# EAGLE design Mbus_1.2 (EAGLE 9.6.2)
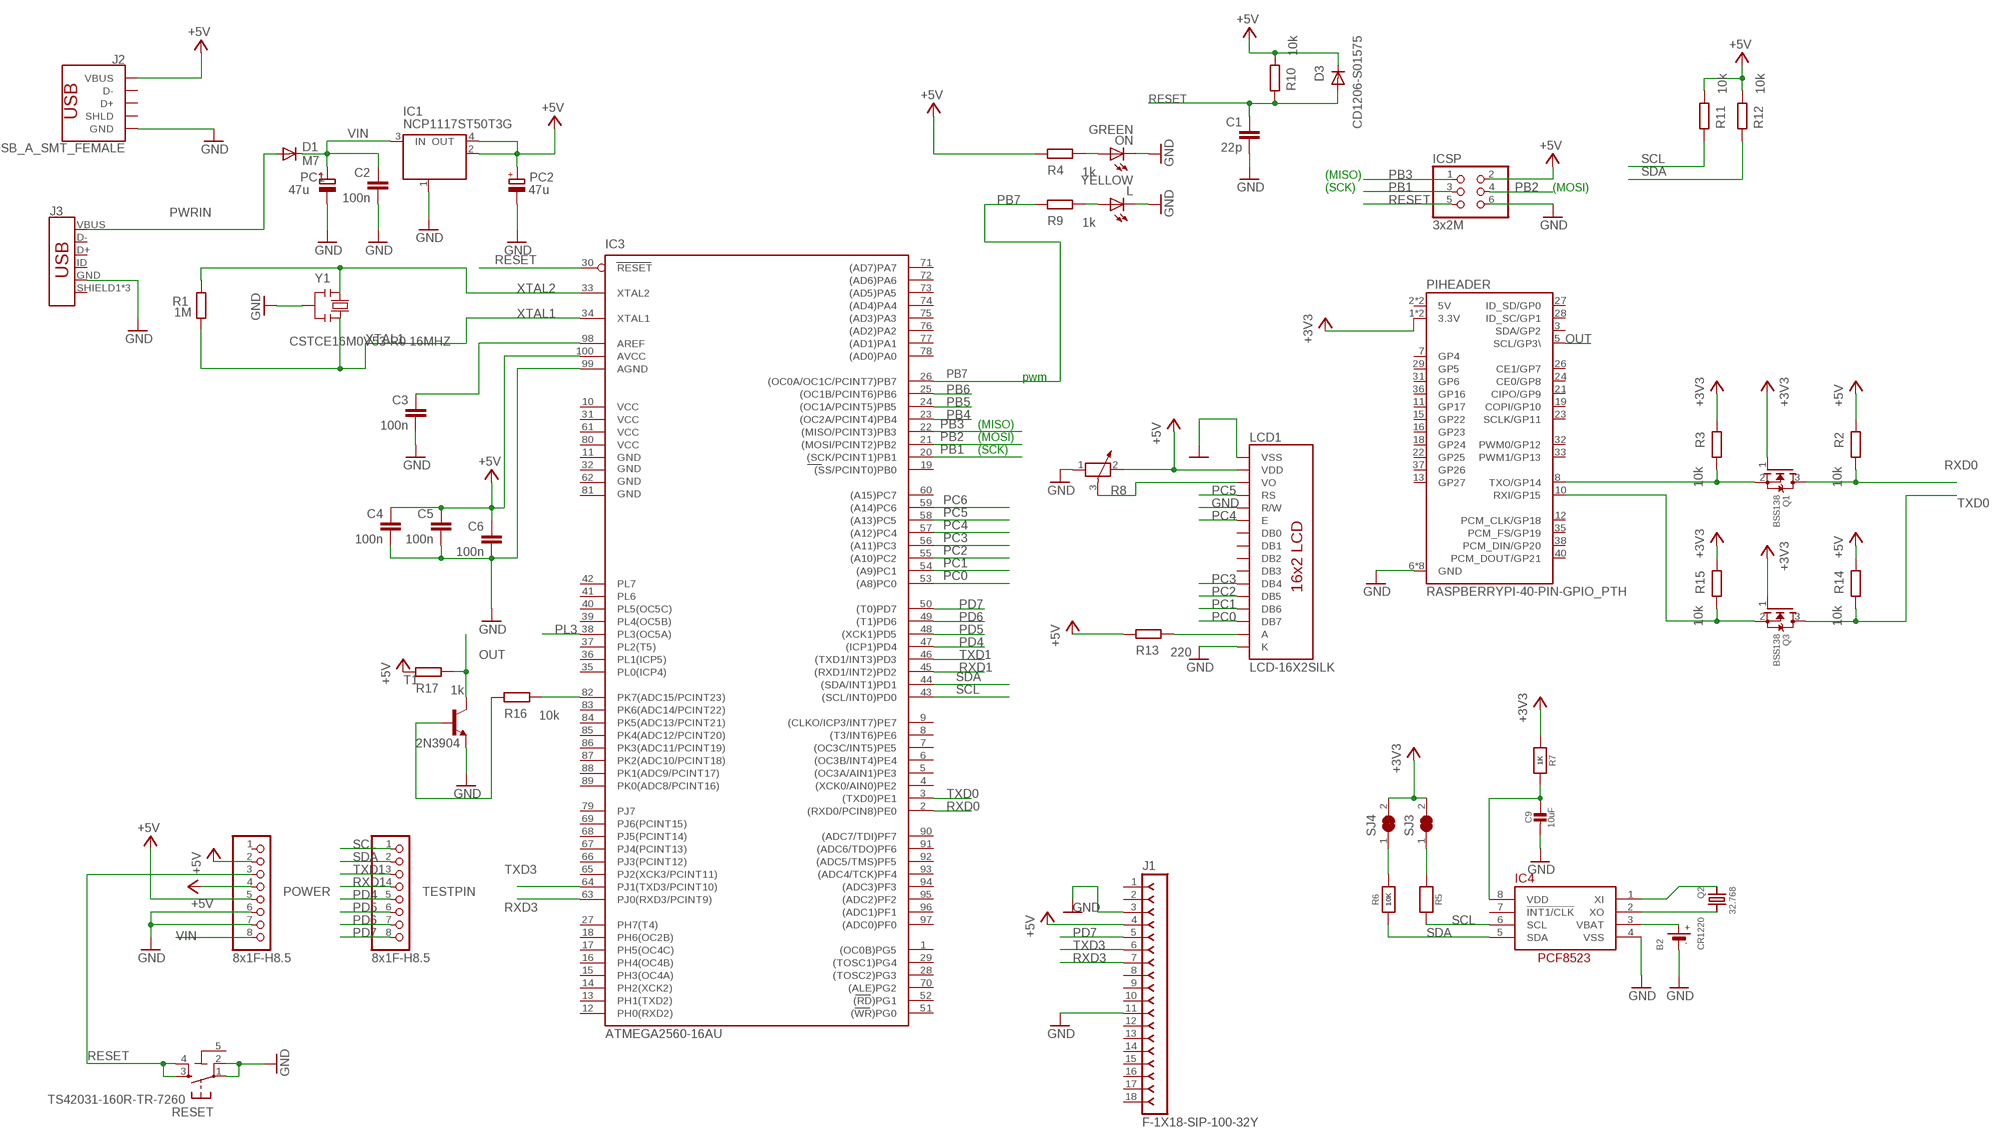
[diagram p0: schematic, sheet 1]

## Parts
B2  CR1220  BATTERYCR1220_SMT  [CR1220]
C1  22p  C-EU0603-RND  [C0603-ROUND]
C2  100n  C-EU0603-RND  [C0603-ROUND]
C3  100n  C-EU0603-RND  [C0603-ROUND]
C4  100n  C-EU0603-RND  [C0603-ROUND]
C5  100n  C-EU0603-RND  [C0603-ROUND]
C6  100n  C-EU0603-RND  [C0603-ROUND]
C9  10uF  CAP_CERAMIC0805-NOOUTLINE  [0805-NO]
D1  M7  DIODE-SMB  [SMB]
D3  CD1206-S01575  DIODE-MINIMELF  [MINIMELF]
IC1  NCP1117ST50T3G  MC33269ST-3.3T3  [SOT223]
IC3  ATMEGA2560-16AU  ATMEGA25602560-16AU  [TQFP100]
IC4  RTC_PCF8523T  [SOIC8_150MIL]
ICSP  3x2M  PINHD-2X3  [2X03]
J1  F-1X18-SIP-100-32Y  [SIP-100-18-32Y]
J2  USB_A_SMT_FEMALE  [USB-A-S-SILK-FEMALE]
J3  USB_MICRO-B_FEMALE-SMT  [USB-B-MICRO-SMD]
L  YELLOW  LEDCHIP-LED0805  [CHIP-LED0805]
LCD1  LCD-16X2SILK  [LCD-16X2]
ON  GREEN  LEDCHIP-LED0805  [CHIP-LED0805]
PC1  47u  CPOL-EUD  [PANASONIC_D]
PC2  47u  CPOL-EUD  [PANASONIC_D]
PIHEADER  RASPBERRYPI-40-PIN-GPIO_PTH  [2X20_SHROUDED]
POWER  8x1F-H8.5  PINHD-1X8  [1X08]
Q1  BSS138  MOSFET-NREFLOW  [SOT23]
Q2  32.768  CRYSTAL8.0X3.8  [CRYSTAL_8X3.8]
Q3  BSS138  MOSFET-NREFLOW  [SOT23]
R1  1M  R-EU_R0603  [R0603-ROUND]
R2  10k  R-EU_R0603  [R0603-ROUND]
R3  10k  R-EU_R0603  [R0603-ROUND]
R4  1k  R-EU_R0603  [R0603-ROUND]
R5  10K  RESISTOR0805_NOOUTLINE  [0805-NO]
R6  10K  RESISTOR0805_NOOUTLINE  [0805-NO]
R7  1K  RESISTOR0805_NOOUTLINE  [0805-NO]
R8  POTENTIOMETER_PT-10  [PT-10]
R9  1k  R-EU_R0603  [R0603-ROUND]
R10  10k  R-EU_R0603  [R0603-ROUND]
R11  10k  R-EU_R0603  [R0603-ROUND]
R12  10k  R-EU_R0603  [R0603-ROUND]
R13  220  R-EU_R0603  [R0603-ROUND]
R14  10k  R-EU_R0603  [R0603-ROUND]
R15  10k  R-EU_R0603  [R0603-ROUND]
R16  10k  R-EU_R0603  [R0603-ROUND]
R17  1k  R-EU_R0603  [R0603-ROUND]
RESET  TS42031-160R-TR-7260  TS42  [TS42]
SJ3  SOLDERJUMPER_CLOSED  [SOLDERJUMPER_CLOSEDWIRE]
SJ4  SOLDERJUMPER_CLOSED  [SOLDERJUMPER_CLOSEDWIRE]
T1  2N3904  [TO92]
TESTPIN  8x1F-H8.5  PINHD-1X8  [1X08]
Y1  CSTCE16M0V53-R0 16MHZ  RESONATORMU  [RESONATOR]

## Nets
+3V3 [power]: PIHEADER.1(3.3V) PIHEADER.17(3.3V) Q1.1(G) Q3.1(G) R3.2 R7.1 R15.2 SJ3.2 SJ4.2
+5V [power]: C4.1 C5.1 C6.1 D3.C IC1.2(OUT) IC1.4(OUT) IC3.100(AVCC) ICSP.2 J1.4 J2.VBUS LCD1.2(VDD) PC2.+ POWER.2 POWER.4 POWER.5 R2.2 R4.2 R8.2 R10.1 R11.1 R12.1 R13.2 R14.2 R17.2
AREF: C3.1 IC3.98(AREF)
GND [gnd]: B2.- C1.2 C2.2 C3.2 C4.2 C5.2 C6.2 C9.2 IC1.1(GND/ADJ) IC3.99(AGND) IC4.4(VSS) ICSP.6 J1.3 J1.11 J2.GND J3.GND L.C LCD1.1(VSS) LCD1.5(R/W) LCD1.16(K) ON.C PC1.- PC2.- PIHEADER.6(GND) PIHEADER.9(GND) PIHEADER.14(GND) PIHEADER.20(GND) PIHEADER.25(GND) PIHEADER.30(GND) PIHEADER.34(GND) PIHEADER.39(GND) POWER.6 POWER.7 R8.1 RESET.1 RESET.2 T1.3(E) Y1.2
N$1: IC3.82(PK7(ADC15/PCINT23)) R16.1
N$2: L.A R9.1
N$3: ON.A R4.1
N$4: R16.2 T1.2(B)
N$5: PIHEADER.8(TXO/GP14) Q1.2(S) R3.1
N$6: IC4.1(XI) Q2.P$1
N$7: IC4.2(XO) Q2.P$4
N$8: R5.1 SJ3.1
N$9: R6.2 SJ4.1
N$10: C9.1 IC4.8(VDD) R7.2
N$11: LCD1.15(A) R13.1
N$12: PIHEADER.10(RXI/GP15) Q3.2(S) R15.1
N$22: LCD1.3(VO) R8.3
OUT: PIHEADER.5(SCL/GP3\) R17.1 T1.1(C)
PB1: IC3.20((SCK/PCINT1)PB1) ICSP.3
PB2: IC3.21((MOSI/PCINT2)PB2) ICSP.4
PB3: IC3.22((MISO/PCINT3)PB3) ICSP.1
PB4: IC3.23((OC2A/PCINT4)PB4)
PB5: IC3.24((OC1A/PCINT5)PB5)
PB6: IC3.25((OC1B/PCINT6)PB6)
PB7: IC3.26((OC0A/OC1C/PCINT7)PB7) R9.2
PC0: IC3.53((A8)PC0) LCD1.14(DB7)
PC1: IC3.54((A9)PC1) LCD1.13(DB6)
PC2: IC3.55((A10)PC2) LCD1.12(DB5)
PC3: IC3.56((A11)PC3) LCD1.11(DB4)
PC4: IC3.57((A12)PC4) LCD1.6(E)
PC5: IC3.58((A13)PC5) LCD1.4(RS)
PC6: IC3.59((A14)PC6)
PD4: IC3.47((ICP1)PD4) TESTPIN.5
PD5: IC3.48((XCK1)PD5) TESTPIN.6
PD6: IC3.49((T1)PD6) TESTPIN.7
PD7: IC3.50((T0)PD7) J1.5 TESTPIN.8
PL3: IC3.38(PL3(OC5A))
PWRIN [power]: D1.A J3.VBUS
RESET: C1.1 D3.A IC3.30(RESET) ICSP.5 POWER.3 R10.2 RESET.3 RESET.4
RXD0: IC3.2((RXD0/PCIN8)PE0) Q1.3(D) R2.1
RXD1: IC3.45((RXD1/INT2)PD2) TESTPIN.4
RXD3: IC3.63(PJ0(RXD3/PCINT9)) J1.7
SCL: IC3.43((SCL/INT0)PD0) IC4.6(SCL) R5.2 R11.2 TESTPIN.1
SDA: IC3.44((SDA/INT1)PD1) IC4.5(SDA) R6.1 R12.2 TESTPIN.2
TXD0: IC3.3((TXD0)PE1) Q3.3(D) R14.1
TXD1: IC3.46((TXD1/INT3)PD3) TESTPIN.3
TXD3: IC3.64(PJ1(TXD3/PCINT10)) J1.6
VBAT1: B2.+$1(+) IC4.3(VBAT)
VIN [power]: C2.1 D1.C IC1.3(IN) PC1.+ POWER.8
XTAL1: IC3.34(XTAL1) R1.1 Y1.3
XTAL2: IC3.33(XTAL2) R1.2 Y1.1
Unconnected: IC3.1((OC0B)PG5) IC3.4((XCK0/AIN0)PE2) IC3.5((OC3A/AIN1)PE3) IC3.6((OC3B/INT4)PE4) IC3.7((OC3C/INT5)PE5) IC3.8((T3/INT6)PE6) IC3.9((CLKO/ICP3/INT7)PE7) IC3.12(PH0(RXD2)) IC3.13(PH1(TXD2)) IC3.14(PH2(XCK2)) IC3.15(PH3(OC4A)) IC3.16(PH4(OC4B)) IC3.17(PH5(OC4C)) IC3.18(PH6(OC2B)) IC3.19((SS/PCINT0)PB0) IC3.27(PH7(T4)) IC3.28((TOSC2)PG3) IC3.29((TOSC1)PG4) IC3.35(PL0(ICP4)) IC3.36(PL1(ICP5)) IC3.37(PL2(T5)) IC3.39(PL4(OC5B)) IC3.40(PL5(OC5C)) IC3.41(PL6) IC3.42(PL7) IC3.51((WR)PG0) IC3.52((RD)PG1) IC3.60((A15)PC7) IC3.65(PJ2(XCK3/PCINT11)) IC3.66(PJ3(PCINT12)) IC3.67(PJ4(PCINT13)) IC3.68(PJ5(PCINT14)) IC3.69(PJ6(PCINT15)) IC3.70((ALE)PG2) IC3.71((AD7)PA7) IC3.72((AD6)PA6) IC3.73((AD5)PA5) IC3.74((AD4)PA4) IC3.75((AD3)PA3) IC3.76((AD2)PA2) IC3.77((AD1)PA1) IC3.78((AD0)PA0) IC3.79(PJ7) IC3.83(PK6(ADC14/PCINT22)) IC3.84(PK5(ADC13/PCINT21)) IC3.85(PK4(ADC12/PCINT20)) IC3.86(PK3(ADC11/PCINT19)) IC3.87(PK2(ADC10/PCINT18)) IC3.88(PK1(ADC9/PCINT17)) IC3.89(PK0(ADC8/PCINT16)) IC3.90((ADC7/TDI)PF7) IC3.91((ADC6/TDO)PF6) IC3.92((ADC5/TMS)PF5) IC3.93((ADC4/TCK)PF4) IC3.94((ADC3)PF3) IC3.95((ADC2)PF2) IC3.96((ADC1)PF1) IC3.97((ADC0)PF0) IC4.7(!INT1/CLK) J1.1 J1.2 J1.8 J1.9 J1.10 J1.12 J1.13 J1.14 J1.15 J1.16 J1.17 J1.18 J2.D+ J2.D- J2.SHLD1(SHLD) J2.SHLD2(SHLD) J3.D+ J3.D- J3.ID J3.SHIELD1(SHIELD) J3.SHIELD2(SHIELD) J3.SHIELD3(SHIELD) LCD1.7(DB0) LCD1.8(DB1) LCD1.9(DB2) LCD1.10(DB3) PIHEADER.3(SDA/GP2) PIHEADER.7(GP4) PIHEADER.11(GP17) PIHEADER.12(PCM_CLK/GP18) PIHEADER.13(GP27) PIHEADER.15(GP22) PIHEADER.16(GP23) PIHEADER.18(GP24) PIHEADER.19(COPI/GP10) PIHEADER.21(CIPO/GP9) PIHEADER.22(GP25) PIHEADER.23(SCLK/GP11) PIHEADER.24(CE0/GP8) PIHEADER.26(CE1/GP7) PIHEADER.27(ID_SD/GP0) PIHEADER.28(ID_SC/GP1) PIHEADER.29(GP5) PIHEADER.31(GP6) PIHEADER.32(PWM0/GP12) PIHEADER.33(PWM1/GP13) PIHEADER.35(PCM_FS/GP19) PIHEADER.36(GP16) PIHEADER.37(GP26) PIHEADER.38(PCM_DIN/GP20) PIHEADER.40(PCM_DOUT/GP21) POWER.1

## Notes on the sheet
- (MISO)
- (SCK) | (MOSI)
- pwm
- (MISO)
- (MOSI)
- (SCK)

## Power pins joined to a net without a drawn wire
5-GND: RESET.5(5-GND)
5V: PIHEADER.2(5V) PIHEADER.4(5V)
GND: IC3.11(GND)
GND1: IC3.32(GND1)
GND2: IC3.62(GND2)
GND3: IC3.81(GND3)
VCC: IC3.10(VCC)
VCC1: IC3.31(VCC1)
VCC2: IC3.61(VCC2)
VCC3: IC3.80(VCC3)

## Library data of the parts
B2 = microbuilder:BATTERY: CR1220 SMT - Digikey: 3001K-ND CD2032 BAT-HLD-001 - Digikey: BAT-HLD-001-ND
C1-C6 = SmartPrj:C-EU: CAPACITOR, European symbol
C9 = microbuilder:CAP_CERAMIC: Ceramic Capacitors For new designs, use the packages preceded by an '_' character since they are more reliable: The following footprints should be used on most boards: _0402 - Standard footprint for regular board layouts _0603 - Standard footprint for regular board layouts _0805 - Standard footprint for regular board layouts _1206 - Standard footprint for regular board layouts For extremely tight-pitch boards where space is at a premium, the following 'micro-pitch' footprints can be used (smaller pads, no silkscreen outline, etc.): _0402MP - Micro-pitch footprint for very dense/compact boards _0603MP - Micro-pitch footprint for very dense/compact boards _0805MP - Micro-pitch footprint for very dense/compact boards _1206MP - Micro-pitch footprint for very dense/compact boards
D1 D3 = diode:DIODE-: DIODE
IC1 = linear:MC33269ST*: Adjustable Output Low Dropout Voltage Regulator 800 mA Source: http://www.onsemi.com/pub/Collateral/MC33269-D.PDF
IC3 = SmartPrj:ATMEGA2560: MICROCONTROLLER 64/128/256 Kbytes FLASH 4 Kbytes EEPROM 8 Kbytes SRAM 86 General Purpose I/O pins 12-channels16-bit PWM 4 x Serial USARTs 16-channels 10-bit A/D
IC4 = microbuilder:RTC_PCF8523
ICSP = SmartPrj:PINHD-2X3: PIN HEADER
J1 = con-headers-jp:F-1X18-: FEMALE HEADER
J2 = SparkFun-Connectors:USB_A: USB-A Connector Male and female variants, as well as PTH and SMT variants SparkFun Products: SparkFun XBee Explorer Dongle <https://www.sparkfun.com/products/11697> PTH Male SparkFun MicroView-USB Programmer <https://www.sparkfun.com/products/12924> SMT Male SparkFun USB Type A Female Breakout <https://www.sparkfun.com/products/12700> SMT Female; PROD_ID: CONN-09520; SF_ID: PRT-09011
J3 = SparkFun-Connectors:USB_MICRO-B: USB Type Micro-B Connector Male/female and PTH/SMT variants SparkFun Products: SparkFun microB USB Breakout <https://www.sparkfun.com/products/12035> SparkFun USB microB Plug Breakout <https://www.sparkfun.com/products/10031> SparkFun ESP8266 Thing <https://www.sparkfun.com/products/13231>; PROD_ID: CONN-11752
L ON = led:LED: LED OSRAM: - CHIPLED LG R971, LG N971, LY N971, LG Q971, LY Q971, LO R971, LY R971 LH N974, LH R974 LS Q976, LO Q976, LY Q976 LO Q996 - Hyper CHIPLED LW Q18S LB Q993, LB Q99A, LB R99A - SideLED LS A670, LO A670, LY A670, LG A670, LP A670 LB A673, LV A673, LT A673, LW A673 LH A674 LY A675 LS A676, LA A676, LO A676, LY A676, LW A676 LS A679, LY A679, LG A679 - Hyper Micro SIDELED® LS Y876, LA Y876, LO Y876, LY Y876 LT Y87S - SmartLED LW L88C, LW L88S LB L89C, LB L89S, LG L890 LS L89K, LO L89K, LY L89K LS L896, LA L896, LO L896, LY L896 - TOPLED LS T670, LO T670, LY T670, LG T670, LP T670 LSG T670, LSP T670, LSY T670, LOP T670, LYG T670 LG T671, LOG T671, LSG T671 LB T673, LV T673, LT T673, LW T673 LH T674 LS T676, LA T676, LO T676, LY T676, LB T676, LH T676, LSB T676, LW T676 LB T67C, LV T67C, LT T67C, LS T67K, LO T67K, LY T67K, LW E67C LS E67B, LA E67B, LO E67B, LY E67B, LB E67C, LV E67C, LT E67C LW T67C LS T679, LY T679, LG T679 LS T770, LO T770, LY T770, LG T770, LP T770 LB T773, LV T773, LT T773, LW T773 LH T774 LS E675, LA E675, LY E675, LS T675 LS T776, LA T776, LO T776, LY T776, LB T776 LHGB T686 LT T68C, LB T68C - Hyper Mini TOPLED® LB M676 - Mini TOPLED Santana® LG M470 LS M47K, LO M47K, LY M47K Source: http://www.osram.convergy.de LUXEON: - LUMILED® LXK2-PW12-R00, LXK2-PW12-S00, LXK2-PW14-U00, LXK2-PW14-V00 LXK2-PM12-R00, LXK2-PM12-S00, LXK2-PM14-U00 LXK2-PE12-Q00, LXK2-PE12-R00, LXK2-PE12-S00, LXK2-PE14-T00, LXK2-PE14-U00 LXK2-PB12-K00, LXK2-PB12-L00, LXK2-PB12-M00, LXK2-PB14-N00, LXK2-PB14-P00, LXK2-PB14-Q00 LXK2-PR12-L00, LXK2-PR12-M00, LXK2-PR14-Q00, LXK2-PR14-R00 LXK2-PD12-Q00, LXK2-PD12-R00, LXK2-PD12-S00 LXK2-PH12-R00, LXK2-PH12-S00 LXK2-PL12-P00, LXK2-PL12-Q00, LXK2-PL12-R00 Source: www.luxeon.com KINGBRIGHT: KA-3528ASYC Source: www.kingbright.com
LCD1 = SparkFun-Displays:LCD-16X2: Standard text-only 16x2 parallel input LCD Basic 16 character by 2 line display. Typically utilizes the extremely common HD44780 parallel interface chipset SparkFun Products: Basic 16x2 Green <https://www.sparkfun.com/products/255> Basic 8x2 Green <https://www.sparkfun.com/products/11122>; PROD_ID: LCD-12633; SF_ID: LCD-00255
PC1 PC2 = rcl:CPOL-EU: POLARIZED CAPACITOR, European symbol
PIHEADER = SparkFun-Connectors:RASPBERRYPI-40-PIN-GPIO: Raspberry Pi GPIO Header 2x20 pin connector, as found on B, B+, A+ models. Both shrouded PTH and SMT versions available. SparkFun Products: GPIO Shrouded Header <https://www.sparkfun.com/products/13054>- PTH SparkFun Pi Wedge (Preassembled) <https://www.sparkfun.com/products/13717>; PROD_ID: CONN-12263; SF_ID: PRT-13054
POWER TESTPIN = SmartPrj:PINHD-1X8: PIN HEADER
Q1 Q3 = adafruit:MOSFET-N: N-Channel Mosfet 2N7002E - 60V 260mA SOT23 [Digikey: 2N7002ET1GOSTR-ND] - REEL BSH103 - 30V 850mA SOT23 [Digikey: 568-5013-1-ND]
Q2 = microbuilder:CRYSTAL: Crystals HC49UP - Surface Mount Crystal 4.0MHz 18pF +/-30ppm Surface Mount Crystal [Digikey: 535-9857-1-ND] 12.0 MHz Surface Mount Crystal [Digikey: 535-9869-6-ND] 25.0 MHz Surface Mount Crystal [Digikey: 535-9078-1-ND] 2.5 x 2.0mm - MEMs SMT Crystal 16.0 MHz 10pF 20ppm 2.5 x 2.0mm Crystal [Digikey -40-85°C: 535-10923-1-ND] 3.2 x 2.5mm - MEMs SMT Crystal 12.0 MHz 8pF 15ppm 3.2 x 2.5mm Crystal [Digikey: -10-70°C: 644-1047-1-ND -40-125°C: 644-1128-1-ND] 40~85°C cheaper: 644-1173-6-ND 16.0 MHz 8pF 15ppm 3.2 x 2.5mm Crystal [Digikey: -10-70°C: 644-1049-1-ND -40-125°C: 644-1129-2-ND]-40~85°C cheaper: 644-1175-6-ND 16.0 MHz 10pF 10ppm 3.2 x 2.5mm Crystal [Digikey: 644-1100-1-ND] 27.12 MHz 18pF 30ppm 3.2 x 2.5mm Crystal [Digikey: 887-1424-1-ND] 27.12MHz 10pF 10ppm 3.2 x 2.5mm Crystal [Digikey: 887-1329-1-ND] 4.9 x 1.8mm - MEMs SMT Crystal 32.768 KHz 12.5pF 20ppm 4.9 x 1.8mm Crystal [Digikey: SE2415CT-ND] 8.0 x 3.8mm - Surface Mount Crystal 32.768kHz 12.5pF 20ppm -40°C-85°C [Digikey: 535-9166-2-ND] Cylinder 32.768KHz Cylinder Crystal (2x6mm body) [Ex. Digikey: 300-8341-2-ND]
R1-R4 R9-R17 = SmartPrj:R-EU_: RESISTOR, European symbol
R5-R7 = microbuilder:RESISTOR: Resistors For new designs, use the packages preceded by an '_' character since they are more reliable: The following footprints should be used on most boards: _0402 - Standard footprint for regular board layouts _0603 - Standard footprint for regular board layouts _0805 - Standard footprint for regular board layouts _1206 - Standard footprint for regular board layouts For extremely tight-pitch boards where space is at a premium, the following 'micro-pitch' footprints can be used (smaller pads, no silkscreen outline, etc.): _0402MP - Micro-pitch footprint for very dense/compact boards _0603MP - Micro-pitch footprint for very dense/compact boards _0805MP - Micro-pitch footprint for very dense/compact boards _1206MP - Micro-pitch footprint for very dense/compact boards
R8 = rcl@1:POTENTIOMETER_: Potentiometer; SPICEMODEL: POT; SPICEPREFIX: X
RESET = SmartPrj:TS42: TS42 Dongnan Electronics Tact switch VDC 12V - 50mA
SJ3 SJ4 = microbuilder:SOLDERJUMPER_CLOSED: Solder Jumper - Closed These solder jumpers are closed by default CLOSEDWIRE - 10 mil trace between pads that can be cut and resoldered later CLOSEDPERM - 63 mil trace between pads for a permanent connection (used to 'bridge' two signals, a shameless hack for Eagle). Can double as a test point as well (no cream layer)
T1 = transistor:2N3904: NPN TRANSISTOR
Y1 = SmartPrj:RESONATOR

## Net classes
0 default: width 0.203 mm, drill 0.305 mm, clearance 0.203 mm
1 power: width 0.813 mm, drill 0.864 mm, clearance 0.254 mm
2 gnd: width 0.61 mm, drill 0.66 mm, clearance 0.254 mm
3 power usb: width 0.813 mm, drill 0.864 mm, clearance 0.254 mm

## Board
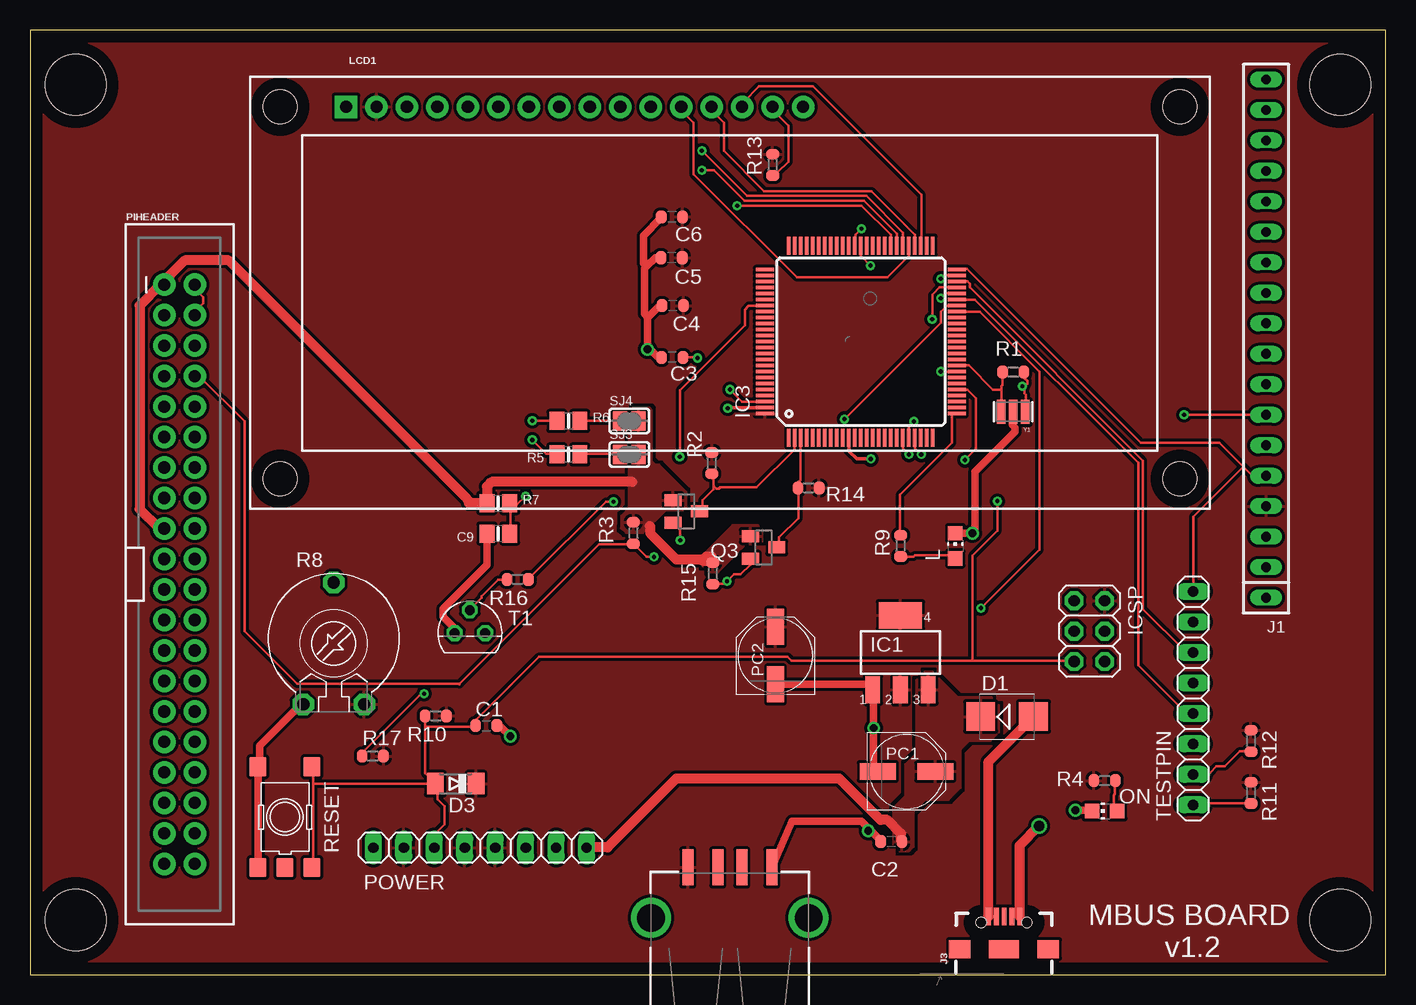
[diagram p1: board, top side]
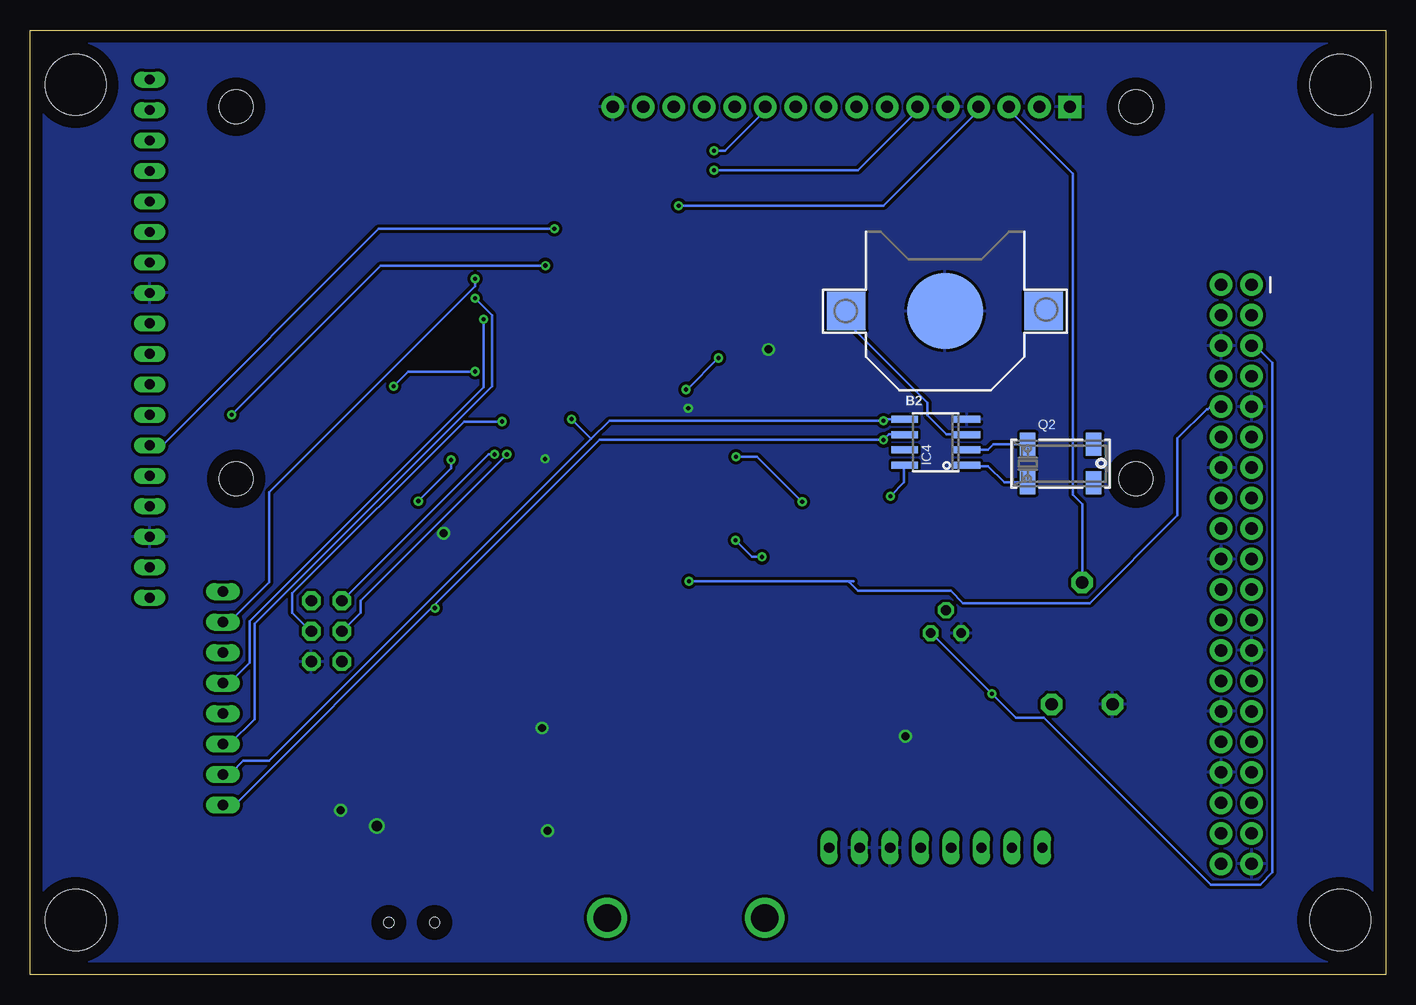
[diagram p2: board, bottom side, seen from below]

Size 113.03 x 78.74 mm. Coordinates in mm from the lower left corner, seen from the top.
Outline: 0,0 113.03,0 113.03,78.74 0,78.74 0,0
Copper layers (1*16): Top 0.035mm / dielectric 1.5mm / Bottom 0.035mm
Design rules "default": minimum track width 6mil, minimum drill 0.35mm, track to track 6mil, track to pad 6mil, pad to pad 6mil, via to via 6mil, smd to smd 6mil, copper to edge 40mil, drill to drill 6mil, minimum pad ring 10mil, minimum via ring 8mil, stop-mask expansion 4mil, vias tented up to drill 0mil, thermal gap 10mil
Holes 5.08 mm at 3.81,74.17 109.22,4.57 109.22,74.17 3.81,4.57

### Footprints (pad centres in the part's own frame; a part is rotated, then mirrored left to right if it is on the bottom)
CR1220 = smd 3.2 x 3.2: +$1 -8.225,0; +$2 8.225,0 | smd 6.35 x 6.35: - 0,0
C0603-ROUND = smd 0.898 x 1.1: 1 -0.889,0; 2 0.889,0
0805-NO = smd 1.24 x 1.5: 1 -0.95,0; 2 0.95,0
SMB = smd 2.4 x 2.4: A 2.2,0; C -2.2,0
MINIMELF = smd 1.4 x 1.8: A 1.7,0; C -1.7,0
SOT223 = smd 1.219 x 2.235: 1 -2.311,-3.099; 2 0,-3.099; 3 2.311,-3.099 | smd 3.6 x 2.2: 4 0,3.099
TQFP100 = smd 1.5 x 0.3: 1 -8,6; 2 -8,5.5; 3 -8,5; 4 -8,4.5; 5 -8,4; 6 -8,3.5; 7 -8,3; 8 -8,2.5; 9 -8,2; 10 -8,1.5; 11 -8,1; 12 -8,0.5; 13 -8,0; 14 -8,-0.5; 15 -8,-1; 16 -8,-1.5; 17 -8,-2; 18 -8,-2.5; 19 -8,-3; 20 -8,-3.5; 21 -8,-4; 22 -8,-4.5; 23 -8,-5; 24 -8,-5.5; 25 -8,-6; 51 8,-6; 52 8,-5.5; 53 8,-5; 54 8,-4.5; 55 8,-4; 56 8,-3.5; 57 8,-3; 58 8,-2.5; 59 8,-2; 60 8,-1.5; 61 8,-1; 62 8,-0.5; 63 8,0; 64 8,0.5; 65 8,1; 66 8,1.5; 67 8,2; 68 8,2.5; 69 8,3; 70 8,3.5; 71 8,4; 72 8,4.5; 73 8,5; 74 8,5.5; 75 8,6 | smd 0.3 x 1.5: 26 -6,-8; 27 -5.5,-8; 28 -5,-8; 29 -4.5,-8; 30 -4,-8; 31 -3.5,-8; 32 -3,-8; 33 -2.5,-8; 34 -2,-8; 35 -1.5,-8; 36 -1,-8; 37 -0.5,-8; 38 0,-8; 39 0.5,-8; 40 1,-8; 41 1.5,-8; 42 2,-8; 43 2.5,-8; 44 3,-8; 45 3.5,-8; 46 4,-8; 47 4.5,-8; 48 5,-8; 49 5.5,-8; 50 6,-8; 76 6,8; 77 5.5,8; 78 5,8; 79 4.5,8; 80 4,8; 81 3.5,8; 82 3,8; 83 2.5,8; 84 2,8; 85 1.5,8; 86 1,8; 87 0.5,8; 88 0,8; 89 -0.5,8; 90 -1,8; 91 -1.5,8; 92 -2,8; 93 -2.5,8; 94 -3,8; 95 -3.5,8; 96 -4,8; 97 -4.5,8; 98 -5,8; 99 -5.5,8; 100 -6,8
SOIC8_150MIL = smd 0.6 x 2.2: 1 -1.905,-2.6; 2 -0.635,-2.6; 3 0.635,-2.6; 4 1.905,-2.6; 5 1.905,2.6; 6 0.635,2.6; 7 -0.635,2.6; 8 -1.905,2.6
2X03 = drill 0.95 pad 1.55 octagon: 1 -2.54,-1.27; 2 -2.54,1.27; 3 0,-1.27; 4 0,1.27; 5 2.54,-1.27; 6 2.54,1.27
SIP-100-18-32Y = drill 0.813 long: 1 -21.59,0; 2 -19.05,0; 3 -16.51,0; 4 -13.97,0; 5 -11.43,0; 6 -8.89,0; 7 -6.35,0; 8 -3.81,0; 9 -1.27,0; 10 1.27,0; 11 3.81,0; 12 6.35,0; 13 8.89,0; 14 11.43,0; 15 13.97,0; 16 16.51,0; 17 19.05,0; 18 21.59,0
USB-A-S-SILK-FEMALE = smd 3 x 0.9: D+ 7.212,-1; D- 7.212,1; GND 7.212,-3.5; VBUS 7.212,3.5 | drill 2.311: SHLD1 3,-6.566; SHLD2 3,6.566
USB-B-MICRO-SMD = smd 1.45 x 0.4: D+ 2.725,0; D- 2.725,0.65; GND 2.725,-1.3; ID 2.725,-0.65; VBUS 2.725,1.3 | smd 1.5 x 1.8: SHIELD1 0,3.685; SHIELD2 0,-3.685 | smd 1.5 x 2.5: SHIELD3 0,0 | hole 0.85: 2.2,1.9; 2.2,-1.9
CHIP-LED0805 = smd 1.2 x 1.2: A 0,-1.05; C 0,1.05
LCD-16X2 = drill 1.016 pad 1.88 square: 1 -32,15.5 | drill 1.016 pad 1.88: 2 -29.46,15.5; 3 -26.92,15.5; 4 -24.38,15.5; 5 -21.84,15.5; 6 -19.3,15.5; 7 -16.76,15.5; 8 -14.22,15.5; 9 -11.68,15.5; 10 -9.14,15.5; 11 -6.6,15.5; 12 -4.06,15.5; 13 -1.52,15.5; 14 1.02,15.5; 15 3.56,15.5; 16 6.1,15.5 | hole 2.8: -37.5,15.5; -37.5,-15.5; 37.5,15.5; 37.5,-15.5
PANASONIC_D = smd 3 x 1.4: + 2.4,0; - -2.4,0
2X20_SHROUDED = drill 1.016 pad 1.88: 1 -1.27,24.13; 2 1.27,24.13; 3 -1.27,21.59; 4 1.27,21.59; 5 -1.27,19.05; 6 1.27,19.05; 7 -1.27,16.51; 8 1.27,16.51; 9 -1.27,13.97; 10 1.27,13.97; 11 -1.27,11.43; 12 1.27,11.43; 13 -1.27,8.89; 14 1.27,8.89; 15 -1.27,6.35; 16 1.27,6.35; 17 -1.27,3.81; 18 1.27,3.81; 19 -1.27,1.27; 20 1.27,1.27; 21 -1.27,-1.27; 22 1.27,-1.27; 23 -1.27,-3.81; 24 1.27,-3.81; 25 -1.27,-6.35; 26 1.27,-6.35; 27 -1.27,-8.89; 28 1.27,-8.89; 29 -1.27,-11.43; 30 1.27,-11.43; 31 -1.27,-13.97; 32 1.27,-13.97; 33 -1.27,-16.51; 34 1.27,-16.51; 35 -1.27,-19.05; 36 1.27,-19.05; 37 -1.27,-21.59; 38 1.27,-21.59; 39 -1.27,-24.13; 40 1.27,-24.13
1X08 = drill 0.85 pad 1.422 long: 1 -8.89,0; 2 -6.35,0; 3 -3.81,0; 4 -1.27,0; 5 1.27,0; 6 3.81,0; 7 6.35,0; 8 8.89,0
SOT23 = smd 1 x 1.4: 1 -0.95,-1.1; 2 0.95,-1.1; 3 0,1.1
CRYSTAL_8X3.8 = smd 1.3 x 1.9: P$1 -2.75,-1.6; P$2 2.75,-1.6; P$3 2.75,1.6; P$4 -2.75,1.6
R0603-ROUND = smd 0.898 x 1.1: 1 -0.889,0; 2 0.889,0
PT-10 = drill 1.016 pad 1.778 octagon: 1 -2.54,-5.08; 2 2.54,-5.08; 3 0,5.08
TS42 = smd 1.6 x 1.4: 1 -4.2,2.25; 2 4.2,2.25; 3 -4.2,-2.25; 4 4.2,-2.25; 5 -4.2,0
SOLDERJUMPER_CLOSEDWIRE = smd 1.168 x 1.6: 1 -0.762,0; 2 0.762,0 | smd 0.635 x 0.203: WIRE 0,0
TO92 = drill 0.813 octagon: 1 1.27,0; 2 0,1.905; 3 -1.27,0
RESONATOR = smd 0.7 x 2: 1 -1,0; 2 0,0; 3 1,0

### Placement (x,y rotation side)
B2  36.75,55.31 0 bottom
C1  38.02,20.76 0 top
C2  71.81,11.11 180 top
C3  53.54,51.47 180 top
C4  53.58,55.77 180 top
C5  53.49,59.76 180 top
C6  53.52,63.16 180 top
C9  39.04,36.77 180 top
D1  81.46,21.53 0 top
D3  35.48,15.94 180 top
IC1  72.57,26.86 0 top
IC3  69.27,52.77 90 top
IC4  37.52,44.39 90 bottom
ICSP  88.32,28.64 270 top
J1  103.05,53.02 90 top
J2  58.34,1.75 90 top
J3  81.2,2.15 90 top
L  77.14,35.75 0 top
LCD1  58.34,56.83 0 top
ON  89.59,13.65 90 top
PC1  73.08,16.95 0 top
PC2  62.15,26.61 90 top
PIHEADER  12.46,33.39 0 top
POWER  37.52,10.6 0 top
Q1  54.71,38.62 270 top
Q2  27.1,42.61 0 bottom
Q3  61.15,35.62 270 top
R1  81.97,50.23 0 top
R2  56.84,42.64 90 top
R3  50.3,36.82 90 top
R4  89.59,16.19 180 top
R5  44.88,43.37 180 top
R6  44.88,46.16 0 top
R7  39.04,39.31 0 top
R8  25.32,27.62 0 top
R9  72.57,35.75 90 top
R10  33.82,21.59 180 top
R11  101.78,15.18 270 top
R12  101.78,19.49 270 top
R13  61.9,67.5 90 top
R14  64.9,40.58 0 top
R15  56.92,33.45 90 top
R16  40.65,32.95 180 top
R17  28.58,18.24 0 top
RESET  21.26,13.14 90 top
SJ3  49.96,43.37 0 top
SJ4  49.96,46.16 0 top
T1  36.67,28.48 0 top
TESTPIN  96.95,23.05 90 top
Y1  81.97,46.93 180 top

### Tracks (layer width: path | path; a pad name or v marks a point on that pad's centre or on a via)
5V
  Top 0.203: PIHEADER.4 13.82,55.07 13.82,55.37 14.43,55.98 14.43,56.49 13.82,57.1 13.82,57.51 PIHEADER.2
+3V3
  Top 0.813: 50.2,41.09 38.5,41.09 38.1,40.69 R7.1 | 56.82,34.86 56.62,34.86 56.62,34.63 56.5,34.63 56.5,34.86 56.39,34.86 56.39,34.52 56.05,34.52 55.93,34.63 53.87,34.63 51.7,36.8 51.7,37.38 51.66,37.42 | 37.76,39.43 R7.1 | R3.2 50.32,37.78 50.41,37.78 | R7.1 36.59,39.31 36.47,39.62 16.56,59.54 12.9,59.54 11.28,57.91 PIHEADER.1 11.18,57.51 10.87,57.51 9.14,55.78 9.14,38.81 10.67,37.29 11.18,37.29 PIHEADER.17
  pour Top: 49.96,46.92 49.96,38.93 49.31,38.28 49.31,37.23 49.29,37.21 49.67,36.83 51.12,36.83 53.01,38.72 54.41,38.72 54.69,39.01 54.69,40.25 52.44,42.5 52.13,42.5 51.81,42.83 51.81,47.07 51.64,47.24 50.22,47.24 49.94,46.96 49.94,46.92
  pour Top: 56.09,35 56.09,34.06 56.59,33.56 57.37,33.56 59.69,35.87 60.84,35.87 61.04,36.08 61.04,37.09 60.68,37.46 58.54,37.46
+5V
  pour Top (rank 2): -3.63,78.16 -3.63,-3.72 115.04,-3.72 119.1,0.34 119.1,81.91 0.11,81.91
AREF  (via drill 0.35)
  Top 0.203: C3.1 55.59,51.47 v55.64,51.41 | IC3.98 59.36,47.77 v58.35,48.78
  Bottom 0.203: v55.64,51.41 58.27,48.78 v58.35,48.78
GND  (via drill 0.36, 0.66, 0.86)
  Top 0.305: IC3.11 68.27,43.65 68.92,43 v70.09,43 | IC3.99 61.26,47.26 58.2,47.26 v58.16,47.22
  Top 0.61: PC1.- 70.67,17.03 70.33,17.37 v70.33,20.57 70.33,23.66 IC1.1 70.1,24 69.88,24.23 62.22,24.23 PC2.- | 69.99,12.12 69.3,12.8 63.52,12.8 J2.GND | 69.99,12.12 70.9,11.2 C2.2 | 51.59,52.23 51.47,52.35 51.47,54.75 | 51.59,52.23 52.27,51.55 52.62,51.55 C3.2 | 51.47,54.75 52.62,55.89 52.73,55.78 C4.2 | 51.42,59.04 51.24,58.86 51.24,55.09 51.36,54.98 51.47,54.75 | 51.42,59.04 52.16,59.78 52.5,59.78 C5.2 | C6.2 52.62,63.09 51.13,61.61 51.13,59.32 51.42,59.04 | RESET.1 19.01,9.03 19.01,17.26 RESET.2 19.13,17.6 19.13,19.09 22.55,22.52 22.78,22.52 R8.1 | v40.04,19.89 39.24,20.69 39.01,20.69 C1.2 | v87.14,13.72 88.51,13.72 ON.C | L.C 77.19,36.8 v78.56,36.8 78.68,37.03 78.79,37.15 78.79,41.95 82.11,45.26 82.11,45.61 81.88,45.83 81.88,45.95 81.99,46.06 81.99,46.86 Y1.2 | C9.2 38.1,36.69 38.1,34.18 34.44,30.52 34.44,29.83 35.36,28.92 35.36,28.57 T1.3 | v51.47,52.12 51.59,52.23 | v69.88,12 69.99,12.12
  Top 0.813: J3.GND 82.5,10.8 v84.11,12.41
  pour Bottom (rank 2): -10.92,83.52 -10.92,-10.92 -9.91,-11.94 122.94,-11.94 122.94,83.52
N$1  (via drill 0.35)
  Top 0.203: R16.1 48.01,39.42 v48.66,39.42 | v54.17,43.17 54.17,48.72 59.59,54.14 59.59,55.45 59.91,55.77 IC3.82
  Bottom 0.203: v48.66,39.42 52.41,43.17 v54.17,43.17
N$2
  Top 0.203: R9.1 73.65,34.86 73.76,34.98 76.85,34.98 77.08,34.75 L.A
N$3
  Top 0.203: R4.1 90.45,16.12 90.45,15.09 90.33,14.97 90.33,13.95 90.56,13.72 ON.A
N$4
  Top 0.203: R16.2 39.7,32.92 39.01,32.92 37.64,31.55 37.64,31.43 36.61,30.4 T1.2
N$5  (via drill 0.35)
  Top 0.203: 53.53,37.72 Q1.2 54.21,37.07 v54.21,36.21 | 35.81,24.23 35.76,24.23 35.8,24.27 | 35.8,24.27 47.42,35.89 50.22,35.89 R3.1 51.41,34.83 v52.02,34.83 | PIHEADER.8 13.82,49.89 14.12,49.89 17.88,46.13 17.88,28.65 22.26,24.27 35.8,24.27
  Bottom 0.203: v52.02,34.83 52.83,34.83 v54.21,36.21
N$6
  Bottom 0.203: Q2.P$1 29.87,41.03 31.81,41.03 33.19,42.41 34.9,42.41 IC4.1
N$7
  Bottom 0.203: Q2.P$4 29.87,44.23 32.73,44.23 33.19,43.78 34.9,43.78 IC4.2
N$8
  Top 0.203: R5.1 45.87,43.43 49.19,43.43 SJ3.1
N$9
  Top 0.203: R6.2 45.87,46.18 49.19,46.18 SJ4.1
N$10  (via drill 0.35)
  Top 0.203: 40.04,39.2 40.04,36.8 C9.1 | v41.3,39.89 40.62,39.2 40.04,39.2 | 40.04,39.2 R7.2
  Bottom 0.203: v41.3,39.89 40.16,41.03 40.16,42.41 IC4.8
N$11
  Top 0.203: R13.1 61.99,66.64 62.22,66.86 62.33,66.86 63.25,67.78 63.25,70.75 61.99,72.01 61.99,72.24 LCD1.15
N$12  (via drill 0.35)
  Top 0.203: R15.1 56.96,32.58 57.87,32.58 v58.1,32.8 58.67,33.38 59.24,33.38 60.05,34.18 60.05,34.63 Q3.2
  Bottom 0.203: 44.39,32.8 44.7,32.8 | 44.7,32.8 v58.1,32.8 | 44.7,32.8 44.7,32.72 43.99,32 36.27,32 35.26,30.99 24.69,30.99 17.37,38.3 17.37,44.7 14.94,47.14 14.83,47.14 14.63,47.35 13.82,47.35 PIHEADER.10
N$22
  Bottom 0.203: R8.3 25.3,32.8 25.3,39.2 26.1,40.01 26.1,66.75 31.36,72.01 31.36,72.24 LCD1.3
OUT  (via drill 0.35)
  Top 0.203: v32.84,23.43 32.61,23.43 27.7,18.52 27.7,18.29 R17.1
  Bottom 0.203: T1.1 37.87,28.46 v32.84,23.43 30.85,21.44 28.52,21.44 14.6,7.52 10.46,7.52 9.45,8.53 9.45,51 10.88,52.44 PIHEADER.5
PB1  (via drill 0.35)
  Top 0.203: v73.28,43.37 72.77,43.88 72.77,44.69 IC3.20
  Bottom 0.203: v73.28,43.37 85.47,31.18 85.47,30.16 87,28.64 ICSP.3
PB2  (via drill 0.35)
  Top 0.203: v73.69,46.11 73.28,45.71 73.28,44.79 IC3.21
  Bottom 0.203: v73.69,46.11 76.83,46.11 91.16,31.79 91.16,30.16 89.64,28.64 ICSP.4
PB3  (via drill 0.35)
  Top 0.203: v74.3,43.37 73.79,43.88 73.79,44.69 IC3.22
  Bottom 0.203: v74.3,43.37 74.8,43.37 87,31.18 ICSP.1
PB7
  Top 0.203: R9.2 72.5,36.69 72.5,40.01 76.85,44.35 76.85,46.63 76.96,46.75 77.19,46.75 IC3.26
PC0
  Top 0.203: IC3.53 74.3,60.85 74.3,65.01 65.25,74.05 60.78,74.05 59.46,72.73 59.46,72.43 LCD1.14
PC1
  Top 0.203: IC3.54 73.79,60.85 73.79,61.66 70.13,65.32 61.19,65.32 57.84,68.67 57.84,71.01 56.92,71.92 56.92,72.33 LCD1.13
PC2
  Top 0.203: IC3.55 73.28,60.74 73.28,59.93 71.46,58.12 63.92,58.12 55.3,66.74 55.3,71.01 54.38,71.92 54.38,72.33 LCD1.12
PC3  (via drill 0.35)
  Top 0.203: v56.01,68.67 59.77,64.91 69.72,64.91 72.77,61.86 72.77,60.85 IC3.56
  Bottom 0.203: v56.01,68.67 55.09,68.67 51.84,71.92 51.84,72.33 LCD1.11
PC4  (via drill 0.35)
  Top 0.203: v56.01,67.04 57.02,67.04 59.56,64.5 69.52,64.5 72.26,61.76 72.26,60.85 IC3.57
  Bottom 0.203: v56.01,67.04 44.02,67.04 39.14,71.92 39.14,72.33 LCD1.6
PC5  (via drill 0.35)
  Top 0.203: v58.95,64.1 69.32,64.1 71.75,61.66 71.75,60.85 IC3.58
  Bottom 0.203: v58.95,64.1 41.88,64.1 34.06,71.92 34.06,72.33 LCD1.4
PD4  (via drill 0.35)
  Top 0.203: v75.21,54.65 75.21,56.68 75.82,57.29 77.24,57.29 IC3.47
  Bottom 0.203: v75.21,54.65 75.21,48.96 94.72,29.45 94.72,26 96.34,24.37 96.95,24.37 TESTPIN.5
PD5
  Top 0.203: IC3.48 77.34,57.8 78.16,57.8 78.36,57.59 78.36,57.29 92.79,42.86 92.79,30.47 96.34,26.91 96.95,26.91 TESTPIN.6
PD6  (via drill 0.35)
  Top 0.203: v75.92,58 76.22,58.31 77.24,58.31 IC3.49
  Bottom 0.203: v75.92,58 75.92,57.39 93.09,40.22 93.09,32.7 96.34,29.45 96.95,29.45 TESTPIN.7
PD7
  Top 0.203: 101.14,42.35 101.88,41.6 103.02,41.6 J1.5 | 101.14,42.35 99.14,44.35 92.62,44.35 78.11,58.86 77.31,58.86 IC3.50 | 101.14,42.35 96.97,38.18 96.97,32 TESTPIN.8
PWRIN
  Top 0.813: J3.VBUS 79.9,17.77 D1.A
RESET  (via drill 0.35)
  Top 0.203: 23.58,16.06 23.58,17.26 RESET.4 | 23.58,16.06 23.58,9.03 RESET.3 | 32.96,20.68 32.96,16.8 33.76,16 D3.A | 32.96,20.68 32.96,21.49 R10.2 | 33.98,15.43 33.98,15.77 33.87,15.89 D3.A | 33.98,15.43 33.98,14.63 34.56,14.06 34.56,12.57 33.76,11.77 33.76,10.63 POWER.3 | 78.56,26.18 63.48,26.18 63.13,26.52 42.44,26.52 37.19,21.26 37.19,20.8 C1.1 37.07,20.69 35.1,20.69 35.09,20.68 32.97,20.68 32.96,20.68 | 78.56,26.18 87.02,26.18 ICSP.5 | 33.98,15.43 D3.A | 78.56,26.18 78.56,34.94 80.66,37.03 v80.66,39.48 | IC3.30 77.34,48.76 78.16,48.76 78.87,48.04 78.87,43.85 v77.93,42.91 | D3.A 23.71,15.94 23.58,16.06
  Bottom 0.203: v77.93,42.91 77.93,42.2 v80.66,39.48
RXD0
  Top 0.203: 56.96,40.73 56.96,40.46 56.05,39.55 56.05,38.86 55.82,38.63 Q1.3 | 56.96,40.73 56.96,41.26 56.84,41.38 56.84,41.72 R2.1 | IC3.2 63.73,44.69 63.73,43.78 60.58,40.63 57.53,40.63 57.43,40.53 57.23,40.53 57.02,40.73 56.96,40.73
RXD1
  Top 0.203: IC3.45 77.34,56.27 78.77,56.27 92.38,42.66 92.38,25.79 96.34,21.83 96.95,21.83 TESTPIN.4
RXD3  (via drill 0.35)
  Top 0.203: IC3.63 69.27,59.91 v70.07,59.11 | v96.21,46.68 J1.7
  Bottom 0.203: v70.07,59.11 83.78,59.11 v96.21,46.68
SCL  (via drill 0.35)
  Top 0.203: v41.87,44.58 43.02,43.43 43.93,43.43 R5.2 | R11.2 97.08,14.29 TESTPIN.1 | v79.27,30.57 84.15,35.45 84.15,50.28 79.17,55.26 77.34,55.26 IC3.43
  Bottom 0.203: IC4.6 40.16,45.03 41.41,45.03 v41.87,44.58 65.53,44.58 79.41,30.7 | 79.41,30.7 95.94,14.17 96.85,14.17 TESTPIN.1 | 79.41,30.7 v79.27,30.57
SDA  (via drill 0.35)
  Top 0.203: v41.87,46.18 43.93,46.18 R6.1 | R12.2 101.77,18.63 100.85,18.63 99.59,17.37 98.91,17.37 98.34,16.8 96.97,16.8 TESTPIN.2 | v67.89,46.32 75.92,54.34 75.92,55.26 76.43,55.77 77.24,55.77 IC3.44
  Bottom 0.203: IC4.5 41.76,46.29 v41.87,46.18 64.73,46.18 66.24,44.67 | 66.24,44.67 93.08,17.83 95.25,17.83 96.28,16.8 96.85,16.8 TESTPIN.2 | 66.24,44.67 v67.89,46.32
TXD0
  Top 0.203: Q3.3 62.33,35.66 62.45,35.78 62.45,36.46 64.05,38.06 64.05,40.58 R14.1 64.03,40.63 64.03,41.03 64.24,41.24 64.24,44.69 IC3.3
TXD1  (via drill 0.35)
  Top 0.203: v75.92,56.38 76.33,56.78 77.24,56.78 IC3.46
  Bottom 0.203: v75.92,56.38 74.5,54.95 74.5,49.06 94.31,29.25 94.31,21.32 96.34,19.29 96.95,19.29 TESTPIN.3
TXD3  (via drill 0.35)
  Top 0.203: v69.32,62.17 68.81,61.66 68.81,60.85 IC3.64
  Bottom 0.203: v69.32,62.17 83.95,62.17 101.93,44.18 103.05,44.18 J1.6
VBAT1
  Bottom 0.203: IC4.3 35.01,45.03 36.61,45.03 38.21,46.63 38.21,47.66 44.96,54.41 44.96,55.21 B2.+$1
VIN
  Top 0.813: POWER.8 46.44,10.63 48.16,10.63 53.87,16.34 67.47,16.34 70.9,12.92 71.48,12.92 72.62,11.77 72.62,11.2 C2.1
  pour Top: 73.23,10.32 72.49,10.32 71.99,10.83 71.99,13.91 72.99,14.91 72.99,17.55 73.89,18.46 73.89,24.55 74.59,25.26 75.22,25.26 77.35,23.13 80.13,23.13 80.78,22.47 80.78,20.23 80.05,19.49 78.31,19.49 77.57,18.75 77.57,15.6 76.58,14.61 74.65,14.61 73.63,13.59 73.63,10.66 73.35,10.38 73.17,10.38
XTAL1
  Top 0.203: R1.1 81.08,49.15 80.96,49.03 80.96,48.76 | 80.96,48.76 80.96,46.98 Y1.3 | 80.96,48.76 80.29,48.76 78.26,50.79 77.34,50.79 IC3.34
XTAL2  (via drill 0.35)
  Top 0.203: 82.91,48.92 83.02,49.03 83.02,49.15 83.13,49.26 83.13,49.49 82.91,49.72 82.91,50.18 R1.2 | 82.91,48.92 82.91,48.46 83.02,48.35 83.02,46.98 Y1.1 | v75.92,50.28 77.24,50.28 IC3.33 | v82.73,49.06 82.83,48.96 82.91,48.92
  Bottom 0.203: v75.92,50.28 81.51,50.28 v82.73,49.06

### Text on the board
tNames: MBUS BOARD / v1.2